# EAGLE design midi_schem (EAGLE 9.5.2)
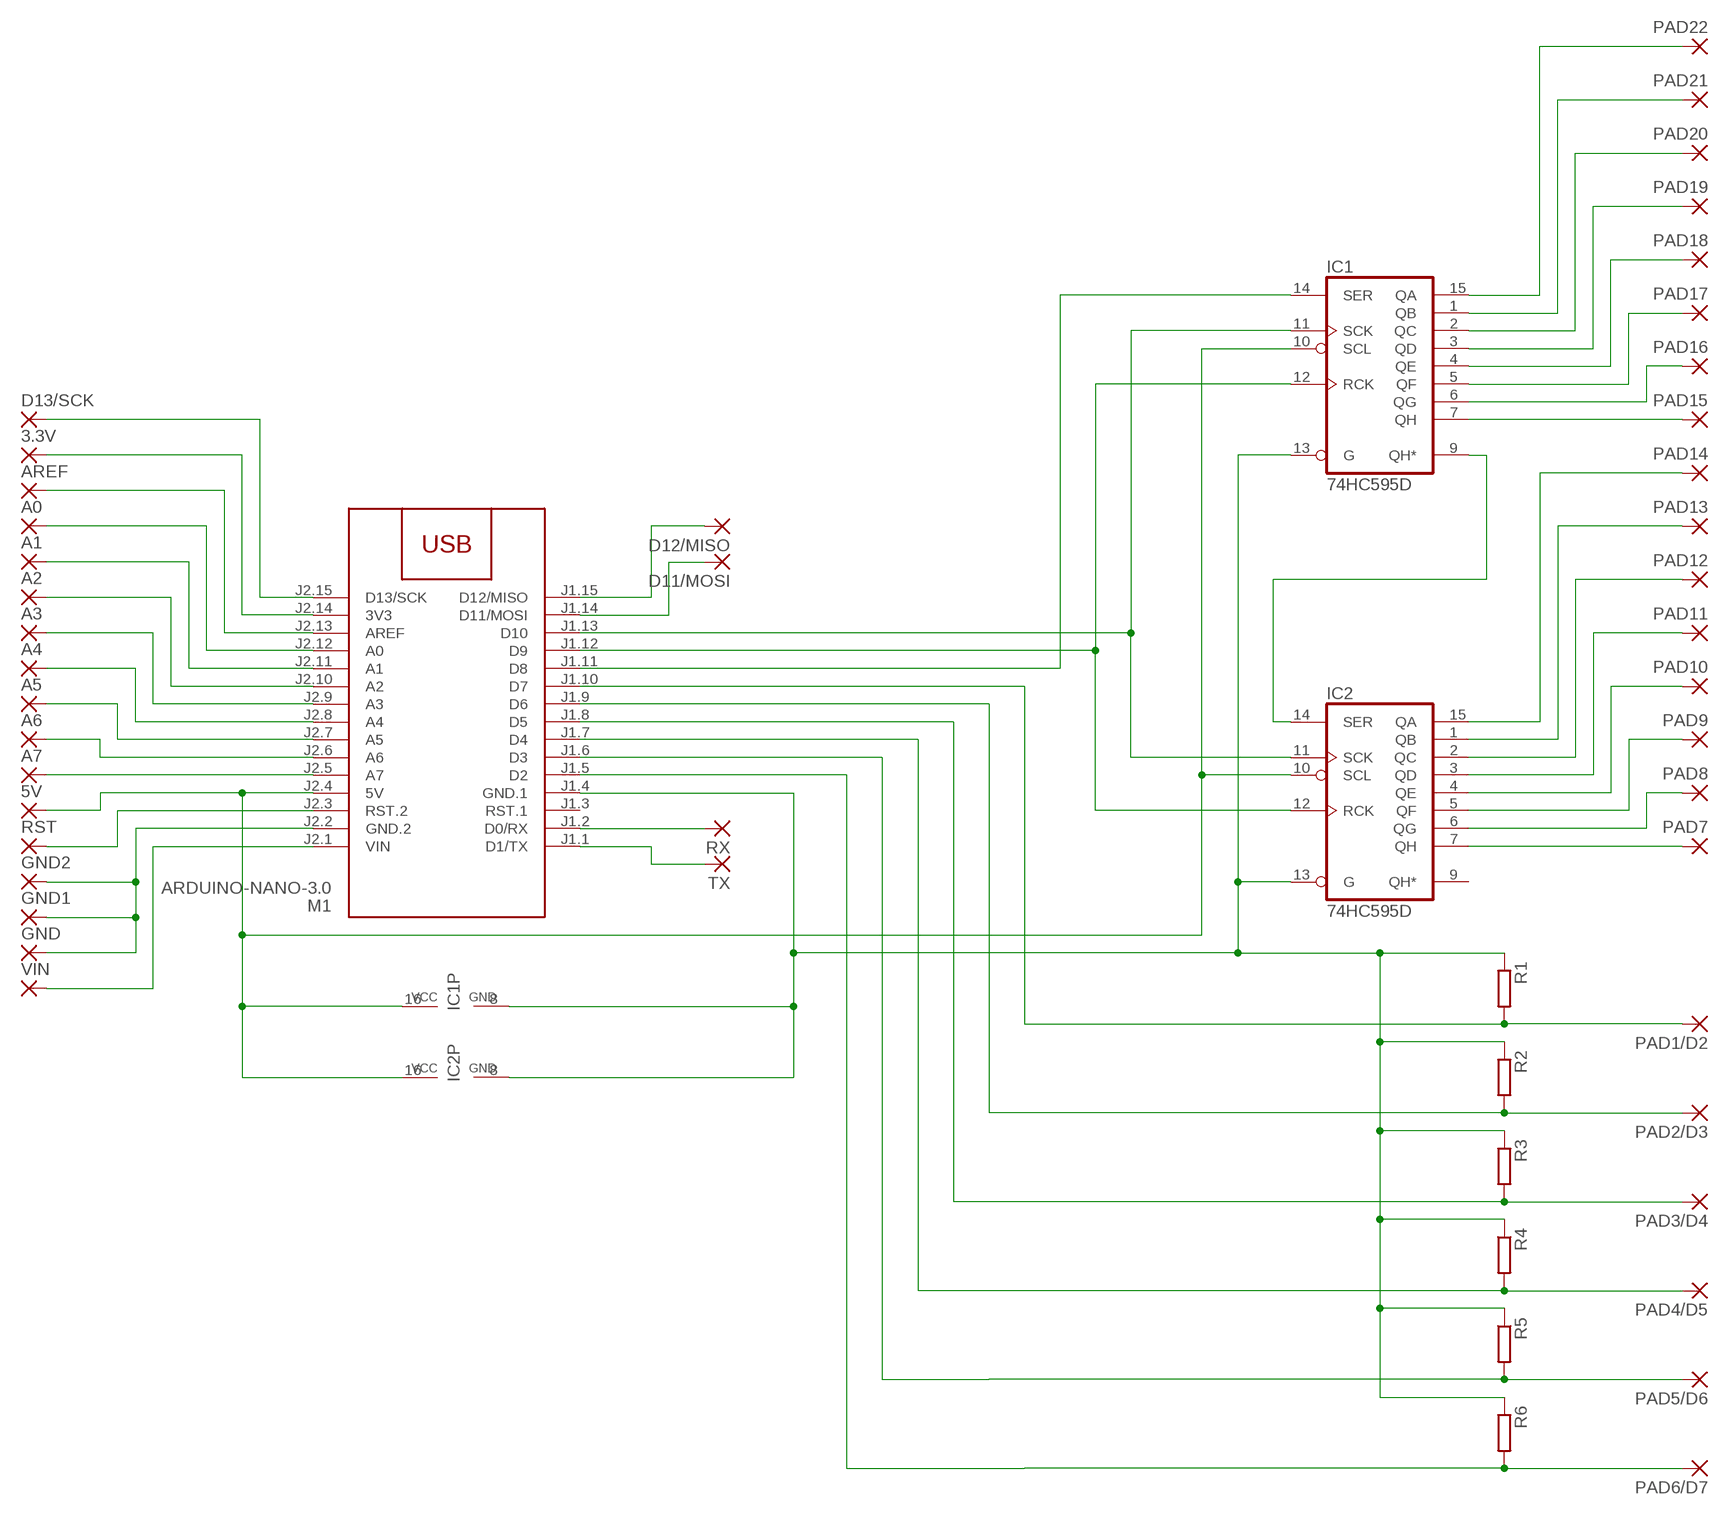
[diagram p0: schematic, sheet 1]

## Parts
3.3V  2,54/0,8  [2,54/0,8]
5V  2,54/0,8  [2,54/0,8]
A0  2,54/0,8  [2,54/0,8]
A1  2,54/0,8  [2,54/0,8]
A2  2,54/0,8  [2,54/0,8]
A3  2,54/0,8  [2,54/0,8]
A4  2,54/0,8  [2,54/0,8]
A5  2,54/0,8  [2,54/0,8]
A6  2,54/0,8  [2,54/0,8]
A7  2,54/0,8  [2,54/0,8]
AREF  2,54/0,8  [2,54/0,8]
D11/MOSI  2,54/0,8  [2,54/0,8]
D12/MISO  2,54/0,8  [2,54/0,8]
D13/SCK  2,54/0,8  [2,54/0,8]
GND  2,54/0,8  [2,54/0,8]
GND1  2,54/0,8  [2,54/0,8]
GND2  2,54/0,8  [2,54/0,8]
IC1  74HC595D  [SO16]
IC2  74HC595D  [SO16]
M1  ARDUINO-NANO-3.0  [ARDUINO-NANO-3.0]
PAD1/D2  SMD2  [SMD1,27-2,54]
PAD2/D3  SMD2  [SMD1,27-2,54]
PAD3/D4  SMD2  [SMD1,27-2,54]
PAD4/D5  SMD2  [SMD1,27-2,54]
PAD5/D6  SMD2  [SMD1,27-2,54]
PAD6/D7  SMD2  [SMD1,27-2,54]
PAD7  SMD2  [SMD1,27-2,54]
PAD8  SMD2  [SMD1,27-2,54]
PAD9  SMD2  [SMD1,27-2,54]
PAD10  SMD2  [SMD1,27-2,54]
PAD11  SMD2  [SMD1,27-2,54]
PAD12  SMD2  [SMD1,27-2,54]
PAD13  SMD2  [SMD1,27-2,54]
PAD14  SMD2  [SMD1,27-2,54]
PAD15  SMD2  [SMD1,27-2,54]
PAD16  SMD2  [SMD1,27-2,54]
PAD17  SMD2  [SMD1,27-2,54]
PAD18  SMD2  [SMD1,27-2,54]
PAD19  SMD2  [SMD1,27-2,54]
PAD20  SMD2  [SMD1,27-2,54]
PAD21  SMD2  [SMD1,27-2,54]
PAD22  SMD2  [SMD1,27-2,54]
R1  R-EU_0207/10  [0207/10]
R2  R-EU_0207/10  [0207/10]
R3  R-EU_0207/10  [0207/10]
R4  R-EU_0207/10  [0207/10]
R5  R-EU_0207/10  [0207/10]
R6  R-EU_0207/10  [0207/10]
RST  2,54/0,8  [2,54/0,8]
RX  2,54/0,8  [2,54/0,8]
TX  2,54/0,8  [2,54/0,8]
VIN  2,54/0,8  [2,54/0,8]

## Nets
N$1: IC1.14(SER) M1.J1.11(D8)
N$2: 5V.1(P) IC1.10(SCL) IC1.16(VCC) IC2.10(SCL) IC2.16(VCC) M1.J2.4(5V)
N$9: IC1.8(GND) IC1.13(G) IC2.8(GND) IC2.13(G) M1.J1.4(GND.1) R1.1 R2.1 R3.1 R4.1 R5.1 R6.1
N$10: IC1.7(QH) PAD15.1(P)
N$11: IC1.6(QG) PAD16.1(P)
N$12: IC1.5(QF) PAD17.1(P)
N$13: IC1.4(QE) PAD18.1(P)
N$14: IC1.3(QD) PAD19.1(P)
N$15: IC1.2(QC) PAD20.1(P)
N$16: IC1.1(QB) PAD21.1(P)
N$17: IC1.15(QA) PAD22.1(P)
N$18: IC2.7(QH) PAD7.1(P)
N$19: IC2.6(QG) PAD8.1(P)
N$20: IC2.5(QF) PAD9.1(P)
N$21: IC2.4(QE) PAD10.1(P)
N$22: IC2.3(QD) PAD11.1(P)
N$23: IC2.2(QC) PAD12.1(P)
N$24: IC2.1(QB) PAD13.1(P)
N$25: IC2.15(QA) PAD14.1(P)
N$26: IC1.12(RCK) IC2.12(RCK) M1.J1.12(D9)
N$27: IC1.11(SCK) IC2.11(SCK) M1.J1.13(D10)
N$28: IC1.9(QH*) IC2.14(SER)
N$29: A7.1(P) M1.J2.5(A7)
N$30: A6.1(P) M1.J2.6(A6)
N$31: A5.1(P) M1.J2.7(A5)
N$32: A4.1(P) M1.J2.8(A4)
N$33: A3.1(P) M1.J2.9(A3)
N$34: A2.1(P) M1.J2.10(A2)
N$35: A1.1(P) M1.J2.11(A1)
N$36: A0.1(P) M1.J2.12(A0)
N$37: AREF.1(P) M1.J2.13(AREF)
N$38: 3.3V.1(P) M1.J2.14(3V3)
N$39: D13/SCK.1(P) M1.J2.15(D13/SCK)
N$40: M1.J1.10(D7) PAD1/D2.1(P) R1.2
N$41: M1.J1.2(D0/RX) RX.1(P)
N$42: M1.J1.1(D1/TX) TX.1(P)
N$43: D11/MOSI.1(P) M1.J1.14(D11/MOSI)
N$44: D12/MISO.1(P) M1.J1.15(D12/MISO)
N$45: M1.J2.3(RST.2) RST.1(P)
N$46: GND1.1(P) GND2.1(P) GND.1(P) M1.J2.2(GND.2)
N$47: M1.J2.1(VIN) VIN.1(P)
N$48: M1.J1.9(D6) PAD2/D3.1(P) R2.2
N$49: M1.J1.8(D5) PAD3/D4.1(P) R3.2
N$50: M1.J1.7(D4) PAD4/D5.1(P) R4.2
N$51: M1.J1.6(D3) PAD5/D6.1(P) R5.2
N$52: M1.J1.5(D2) PAD6/D7.1(P) R6.2
Unconnected: IC2.9(QH*) M1.J1.3(RST.1)

## Library data of the parts
3.3V 5V A0 A1-A7 AREF D11/MOSI D12/MISO D13/SCK GND GND1 GND2 RST RX TX VIN = wirepad:2,54/0,8: THROUGH-HOLE PAD
IC1 IC2 = 74xx-eu:74*595: 8-bit SHIFT REGISTER, output latch
M1 = diy-modules:ARDUINO-NANO-3.0: Arduino Nano 3.0 and compatible devices More details available here: https://www.arduino.cc/en/Main/ArduinoBoardNano Click here to find device on ebay.com <http://www.ebay.com/sch/arduino+nano>
PAD1/D2 PAD2/D3 PAD3/D4 PAD4/D5 PAD5/D6 PAD6/D7 PAD7-PAD22 = wirepad:SMD2: SMD PAD
R1-R6 = resistor:R-EU_: RESISTOR, European symbol

## Board
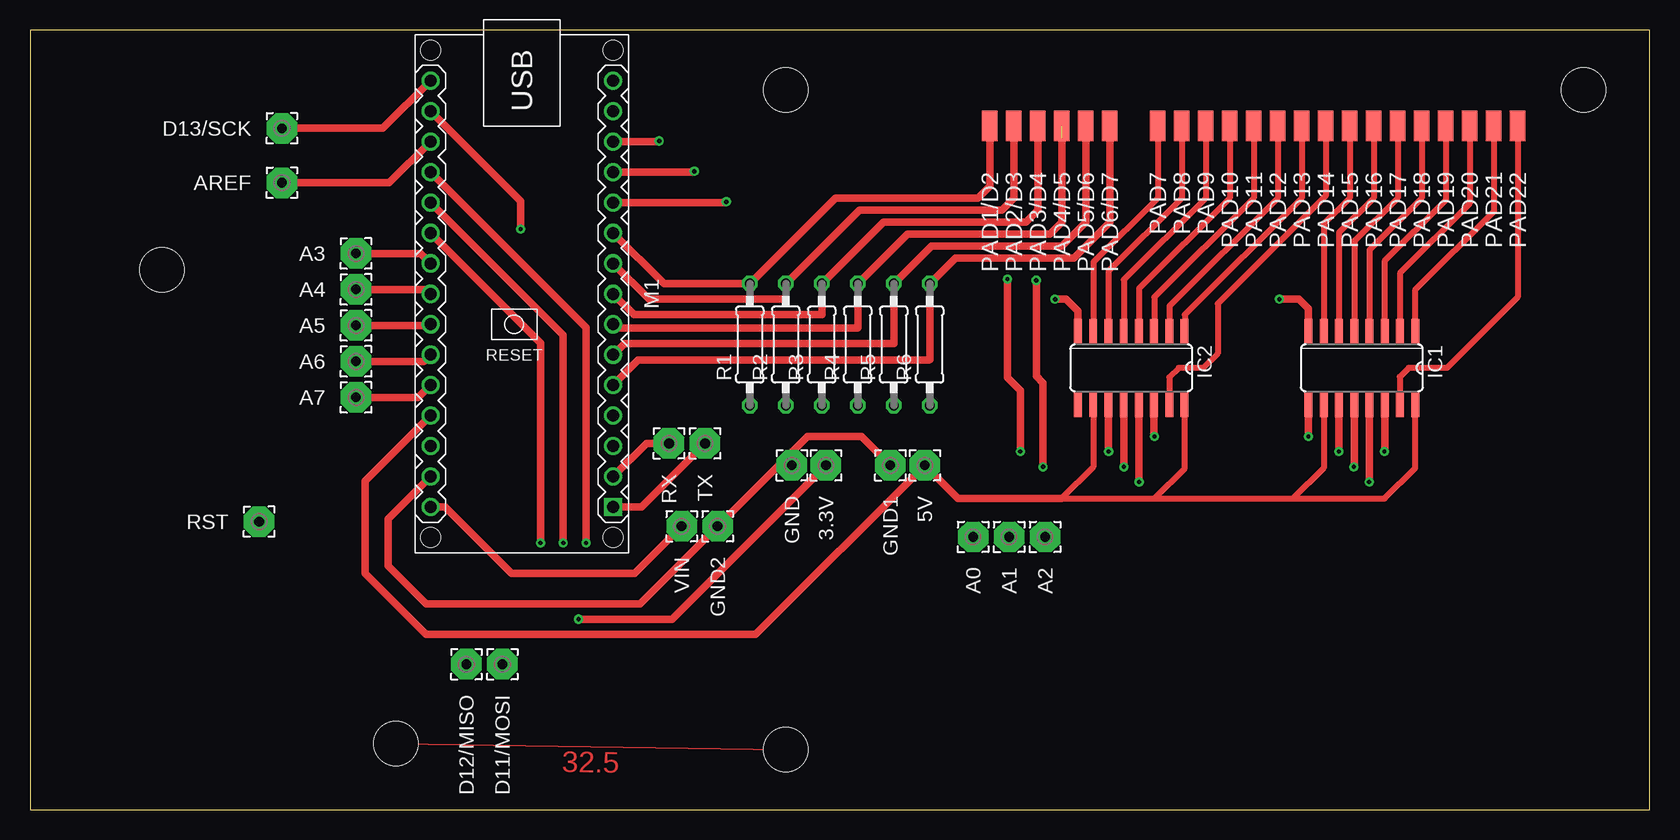
[diagram p1: board, top side]
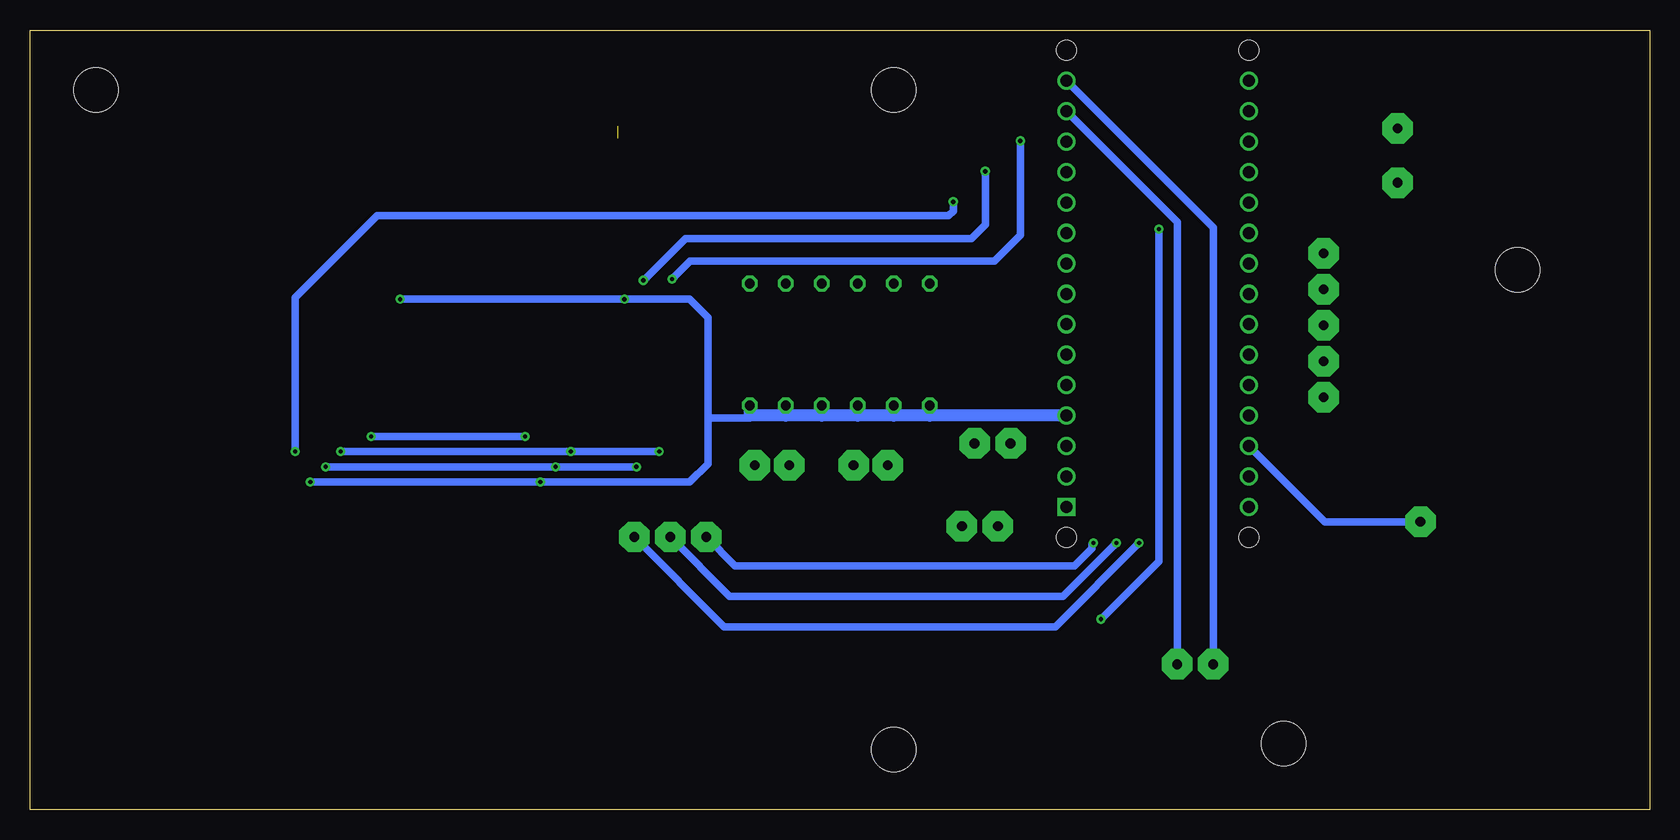
[diagram p2: board, bottom side, seen from below]

Size 135 x 65 mm. Coordinates in mm from the lower left corner, seen from the top.
Outline: 0,0 135,0 135,65 0,65 0,0
Copper layers (1*16): Top 0.035mm / dielectric 1.5mm / Bottom 0.035mm
Design rules "default": minimum track width 6mil, minimum drill 0.35mm, track to track 6mil, track to pad 6mil, pad to pad 6mil, via to via 6mil, smd to smd 6mil, copper to edge 40mil, drill to drill 6mil, minimum pad ring 10mil, minimum via ring 8mil, stop-mask expansion 4mil, vias tented up to drill 0mil, thermal gap 10mil
Holes 3.7 mm at 11,45 63,60 129.5,60 63,5 30.5,5.5

### Footprints (pad centres in the part's own frame; a part is rotated, then mirrored left to right if it is on the bottom)
2,54/0,8 = drill 0.813 pad 2.54 octagon: 1 0,0
SO16 = smd 0.66 x 2.032: 1 -4.445,-3.073; 2 -3.175,-3.073; 3 -1.905,-3.073; 4 -0.635,-3.073; 5 0.635,-3.073; 6 1.905,-3.073; 7 3.175,-3.073; 8 4.445,-3.073; 9 4.445,3.073; 10 3.175,3.073; 11 1.905,3.073; 12 0.635,3.073; 13 -0.635,3.073; 14 -1.905,3.073; 15 -3.175,3.073; 16 -4.445,3.073
ARDUINO-NANO-3.0 = drill 1 square: J1.1 17.78,7.62 | drill 1: J1.2 15.24,7.62; J1.3 12.7,7.62; J1.4 10.16,7.62; J1.5 7.62,7.62; J1.6 5.08,7.62; J1.7 2.54,7.62; J1.8 0,7.62; J1.9 -2.54,7.62; J1.10 -5.08,7.62; J1.11 -7.62,7.62; J1.12 -10.16,7.62; J1.13 -12.7,7.62; J1.14 -15.24,7.62; J1.15 -17.78,7.62; J2.1 17.78,-7.62; J2.2 15.24,-7.62; J2.3 12.7,-7.62; J2.4 10.16,-7.62; J2.5 7.62,-7.62; J2.6 5.08,-7.62; J2.7 2.54,-7.62; J2.8 0,-7.62; J2.9 -2.54,-7.62; J2.10 -5.08,-7.62; J2.11 -7.62,-7.62; J2.12 -10.16,-7.62; J2.13 -12.7,-7.62; J2.14 -15.24,-7.62; J2.15 -17.78,-7.62 | hole 1.651: -20.32,7.62; -20.32,-7.62; 20.32,-7.62; 20.32,7.62
SMD1,27-2,54 = smd 1.27 x 2.54: 1 0,0
0207/10 = drill 0.813 octagon: 1 -5.08,0; 2 5.08,0

### Placement (x,y rotation side)
3.3V  66.35,28.7 90 top
5V  74.59,28.7 90 top
A0  78.62,22.73 90 top
A1  81.62,22.73 90 top
A2  84.62,22.73 90 top
A3  27.18,46.37 0 top
A4  27.18,43.37 0 top
A5  27.18,40.37 0 top
A6  27.18,37.37 0 top
A7  27.18,34.37 0 top
AREF  21,52.27 0 top
D11/MOSI  39.38,12.11 90 top
D12/MISO  36.38,12.11 90 top
D13/SCK  21,56.8 0 top
GND  63.51,28.7 90 top
GND1  71.72,28.7 90 top
GND2  57.32,23.62 90 top
IC1  111.02,36.82 180 top
IC2  91.8,36.82 180 top
M1  41,43 270 top
PAD1/D2  80,57 0 top
PAD2/D3  82,57 0 top
PAD3/D4  84,57 0 top
PAD4/D5  86,57 0 top
PAD5/D6  88,57 0 top
PAD6/D7  90,57 0 top
PAD7  94,57 0 top
PAD8  96,57 0 top
PAD9  98,57 0 top
PAD10  100,57 0 top
PAD11  102,57 0 top
PAD12  104,57 0 top
PAD13  106,57 0 top
PAD14  108,57 0 top
PAD15  110,57 0 top
PAD16  112,57 0 top
PAD17  114,57 0 top
PAD18  116,57 0 top
PAD19  118,57 0 top
PAD20  120,57 0 top
PAD21  122,57 0 top
PAD22  124,57 0 top
R1  60,38.78 90 top
R2  63,38.78 90 top
R3  66,38.78 90 top
R4  69,38.78 90 top
R5  72,38.78 90 top
R6  75,38.78 90 top
RST  19.09,24 0 top
RX  53.27,30.52 90 top
TX  56.27,30.52 90 top
VIN  54.32,23.62 90 top

### Tracks (layer width: path | path; a pad name or v marks a point on that pad's centre or on a via)
N$1  (via drill 0.35)
  Top 0.61: IC1.14 112.92,29.87 v112.9,29.84 | M1.J1.11 57.99,50.62 v58.04,50.67
  Bottom 0.61: v58.04,50.67 58.04,49.91 58.42,49.53 106.05,49.53 112.9,42.67 v112.9,29.84
N$2
  Top 0.508: 107.82,33.73 IC1.10 107.84,28.48 105.28,25.92 | 93.74,25.92 85.98,25.92 88.62,28.57 IC2.10 | 93.74,25.92 96.27,28.45 96.27,33.73 IC2.16 | 93.74,25.92 105.28,25.92 | 105.28,25.92 112.92,25.92 115.47,28.47 IC1.16
  Top 0.61: 85.98,25.92 77.37,25.92 5V.1 60.49,14.61 33.02,14.61 27.94,19.68 27.94,27.4 M1.J2.4
N$9  (via drill 0.35)
  Top 0.61: IC2.8 87.36,41.55 86.36,42.55 v85.45,42.55 | IC1.8 106.58,41.76 105.79,42.55 v104.14,42.55 | IC1.13 111.66,27.33 v111.63,27.3 | IC2.13 92.44,27.33 v92.46,27.3
  Bottom 0.61: 78.49,32.64 75.2,32.64 75,32.84 | v104.14,42.55 v85.45,42.55 80.01,42.55 78.49,41.02 78.49,32.64 | v111.63,27.3 v92.46,27.3 80.01,27.3 78.49,28.83 78.49,32.64
  Bottom 1.016: M1.J1.4 60,32.84 | 60,32.84 63,32.84 | 63,32.84 66,32.84 | 66,32.84 69,32.84 | 69,32.84 72,32.84 | 72,32.84 75,32.84 R6.1 | R1.1 60,32.84 | R2.1 63,32.84 | R3.1 66,32.84 | R4.1 69,32.84 | R5.1 72,32.84
N$10
  Top 0.508: PAD15.1 110,51 107.84,48.84 IC1.7
N$11
  Top 0.508: PAD16.1 112,51 109.11,48.12 IC1.6
N$12
  Top 0.508: PAD17.1 114,51 110.39,47.38 IC1.5
N$13
  Top 0.508: PAD18.1 116,51 111.66,46.66 IC1.4
N$14
  Top 0.508: PAD19.1 118,50.82 112.9,45.72 112.9,39.91 IC1.3
N$15
  Top 0.508: PAD20.1 120,50.53 114.19,44.73 IC1.2
N$16
  Top 0.508: PAD21.1 122,49.86 115.44,43.31 115.44,39.91 IC1.1
N$17
  Top 0.508: PAD22.1 124,42.72 118.11,36.83 114.94,36.83 114.17,36.07 114.17,33.77 IC1.15
N$18
  Top 0.508: IC2.7 88.65,39.91 88.65,45.65 94,51 PAD7.1
N$19
  Top 0.508: PAD8.1 96,51 89.92,44.92 89.92,39.91 IC2.6
N$20
  Top 0.508: PAD9.1 98,51 91.19,44.19 91.19,39.91 IC2.5
N$21
  Top 0.508: PAD10.1 100,51 92.46,43.46 92.46,39.91 IC2.4
N$22
  Top 0.508: PAD11.1 102,51 93.73,42.73 93.73,39.91 IC2.3
N$23
  Top 0.508: PAD12.1 104,51 95,42 95,39.91 IC2.2
N$24
  Top 0.508: PAD13.1 106,51 96.27,41.27 96.27,39.91 IC2.1
N$25
  Top 0.508: PAD14.1 108,51.18 99,42.18 99,38.04 97.79,36.83 95.76,36.83 94.97,36.05 IC2.15
N$26  (via drill 0.35)
  Top 0.61: IC1.12 110.39,28.6 v110.36,28.57 | v91.19,28.57 91.19,33.73 IC2.12 | M1.J1.12 55.32,53.16 v55.37,53.21 | v83.88,44.12 83.88,36.14 84.45,35.56 v84.45,28.57
  Bottom 0.61: v110.36,28.57 v91.19,28.57 v84.45,28.57 | v55.37,53.21 55.37,48.77 56.52,47.62 80.38,47.62 v83.88,44.12
N$27  (via drill 0.35)
  Top 0.61: IC1.11 109.11,29.87 v109.09,29.84 | v89.92,29.84 89.89,29.87 IC2.11 | M1.J1.13 52.4,55.7 v52.45,55.75 | v81.47,44.22 81.47,36.01 82.55,34.92 v82.55,29.84
  Bottom 0.61: v109.09,29.84 v89.92,29.84 v82.55,29.84 | v52.45,55.75 52.45,47.88 54.61,45.72 79.97,45.72 v81.47,44.22
N$28  (via drill 0.35)
  Top 0.61: IC2.14 93.7,31.14 v93.73,31.11 | v106.55,31.11 106.55,33.73 IC1.9
  Bottom 0.61: v93.73,31.11 v106.55,31.11
N$29
  Top 0.61: A7.1 32.37,34.37 M1.J2.5
N$30
  Top 0.61: A6.1 32.83,37.37 M1.J2.6
N$31
  Top 0.61: A5.1 33.28,40.37 M1.J2.7
N$32
  Top 0.61: A4.1 33.02,43.37 M1.J2.8
N$33
  Top 0.61: A3.1 32.55,46.37 M1.J2.9
N$34  (via drill 0.35)
  Top 0.61: M1.J2.10 42.55,38.91 v42.55,22.23
  Bottom 0.61: v42.55,22.23 49.53,15.24 77.13,15.24 A2.1
N$35  (via drill 0.35)
  Top 0.61: M1.J2.11 44.45,39.55 v44.45,22.23
  Bottom 0.61: v44.45,22.23 48.9,17.78 76.67,17.78 A1.1
N$36  (via drill 0.35)
  Top 0.61: M1.J2.12 46.35,40.19 v46.35,22.23
  Bottom 0.61: v46.35,22.23 46.47,22.11 46.47,21.79 47.95,20.32 76.21,20.32 A0.1
N$37
  Top 0.61: AREF.1 29.95,52.27 M1.J2.13
N$38  (via drill 0.35)
  Top 0.61: M1.J2.14 40.89,50.73 v40.89,48.39 | v45.72,15.88 53.53,15.88 3.3V.1
  Bottom 0.61: v40.89,48.39 40.89,20.7 v45.72,15.88
N$39
  Top 0.61: D13/SCK.1 29.39,56.8 M1.J2.15
N$40
  Top 0.61: M1.J1.10 52.84,43.86 R1.2 67.14,51 79,51 80,52 PAD1/D2.1
N$41
  Top 0.61: RX.1 51.38,30.52 M1.J1.2
N$42
  Top 0.61: TX.1 50.96,25.22 M1.J1.1
N$43
  Bottom 0.61: M1.J1.14 39.38,48.99 D11/MOSI.1
N$44
  Bottom 0.61: M1.J1.15 36.38,48.53 D12/MISO.1
N$45
  Bottom 0.61: RST.1 27.08,24 M1.J2.3
N$46
  Top 0.61: M1.J2.2 29.84,24.23 29.84,20.32 33.02,17.14 50.84,17.14 GND2.1 62.25,28.55 62.4,28.7 | 62.4,28.7 GND.1 | GND1.1 69.3,31.11 64.81,31.11 62.4,28.7
N$47
  Top 0.61: VIN.1 50.38,19.68 40.13,19.68 34.6,25.22 M1.J2.1
N$48
  Top 0.61: M1.J1.9 51.62,42.55 62.99,42.55 63,42.55 R2.2 69.14,50 81,50 82,51 PAD2/D3.1
N$49
  Top 0.61: M1.J1.8 50.34,41.27 66.04,41.27 66.04,43.82 R3.2 71.14,49 83,49 84,50 PAD3/D4.1
N$50  (1 unrouted)
  Top 0.61: M1.J1.7 48.95,40.13 68.96,40.13 69,40.17 R4.2 73.14,48 85,48 86,49 86,56
N$51
  Top 0.61: M1.J1.6 49.56,38.86 72.01,38.86 72.01,43.85 R5.2 75.14,47 86,47 88,49 PAD5/D6.1
N$52
  Top 0.61: M1.J1.5 50.7,37.47 74.93,37.47 75,37.53 R6.2 77.14,46 87,46 90,49 PAD6/D7.1
(copper drawn outside any net)
  shapes: Top area x1